# Altium schematic sheet [07] - RS232.SchDoc: IMXBB
size A3; DocumentNumber: 7; Revision: 2.0; SheetNumber: 7; SheetTotal: 13
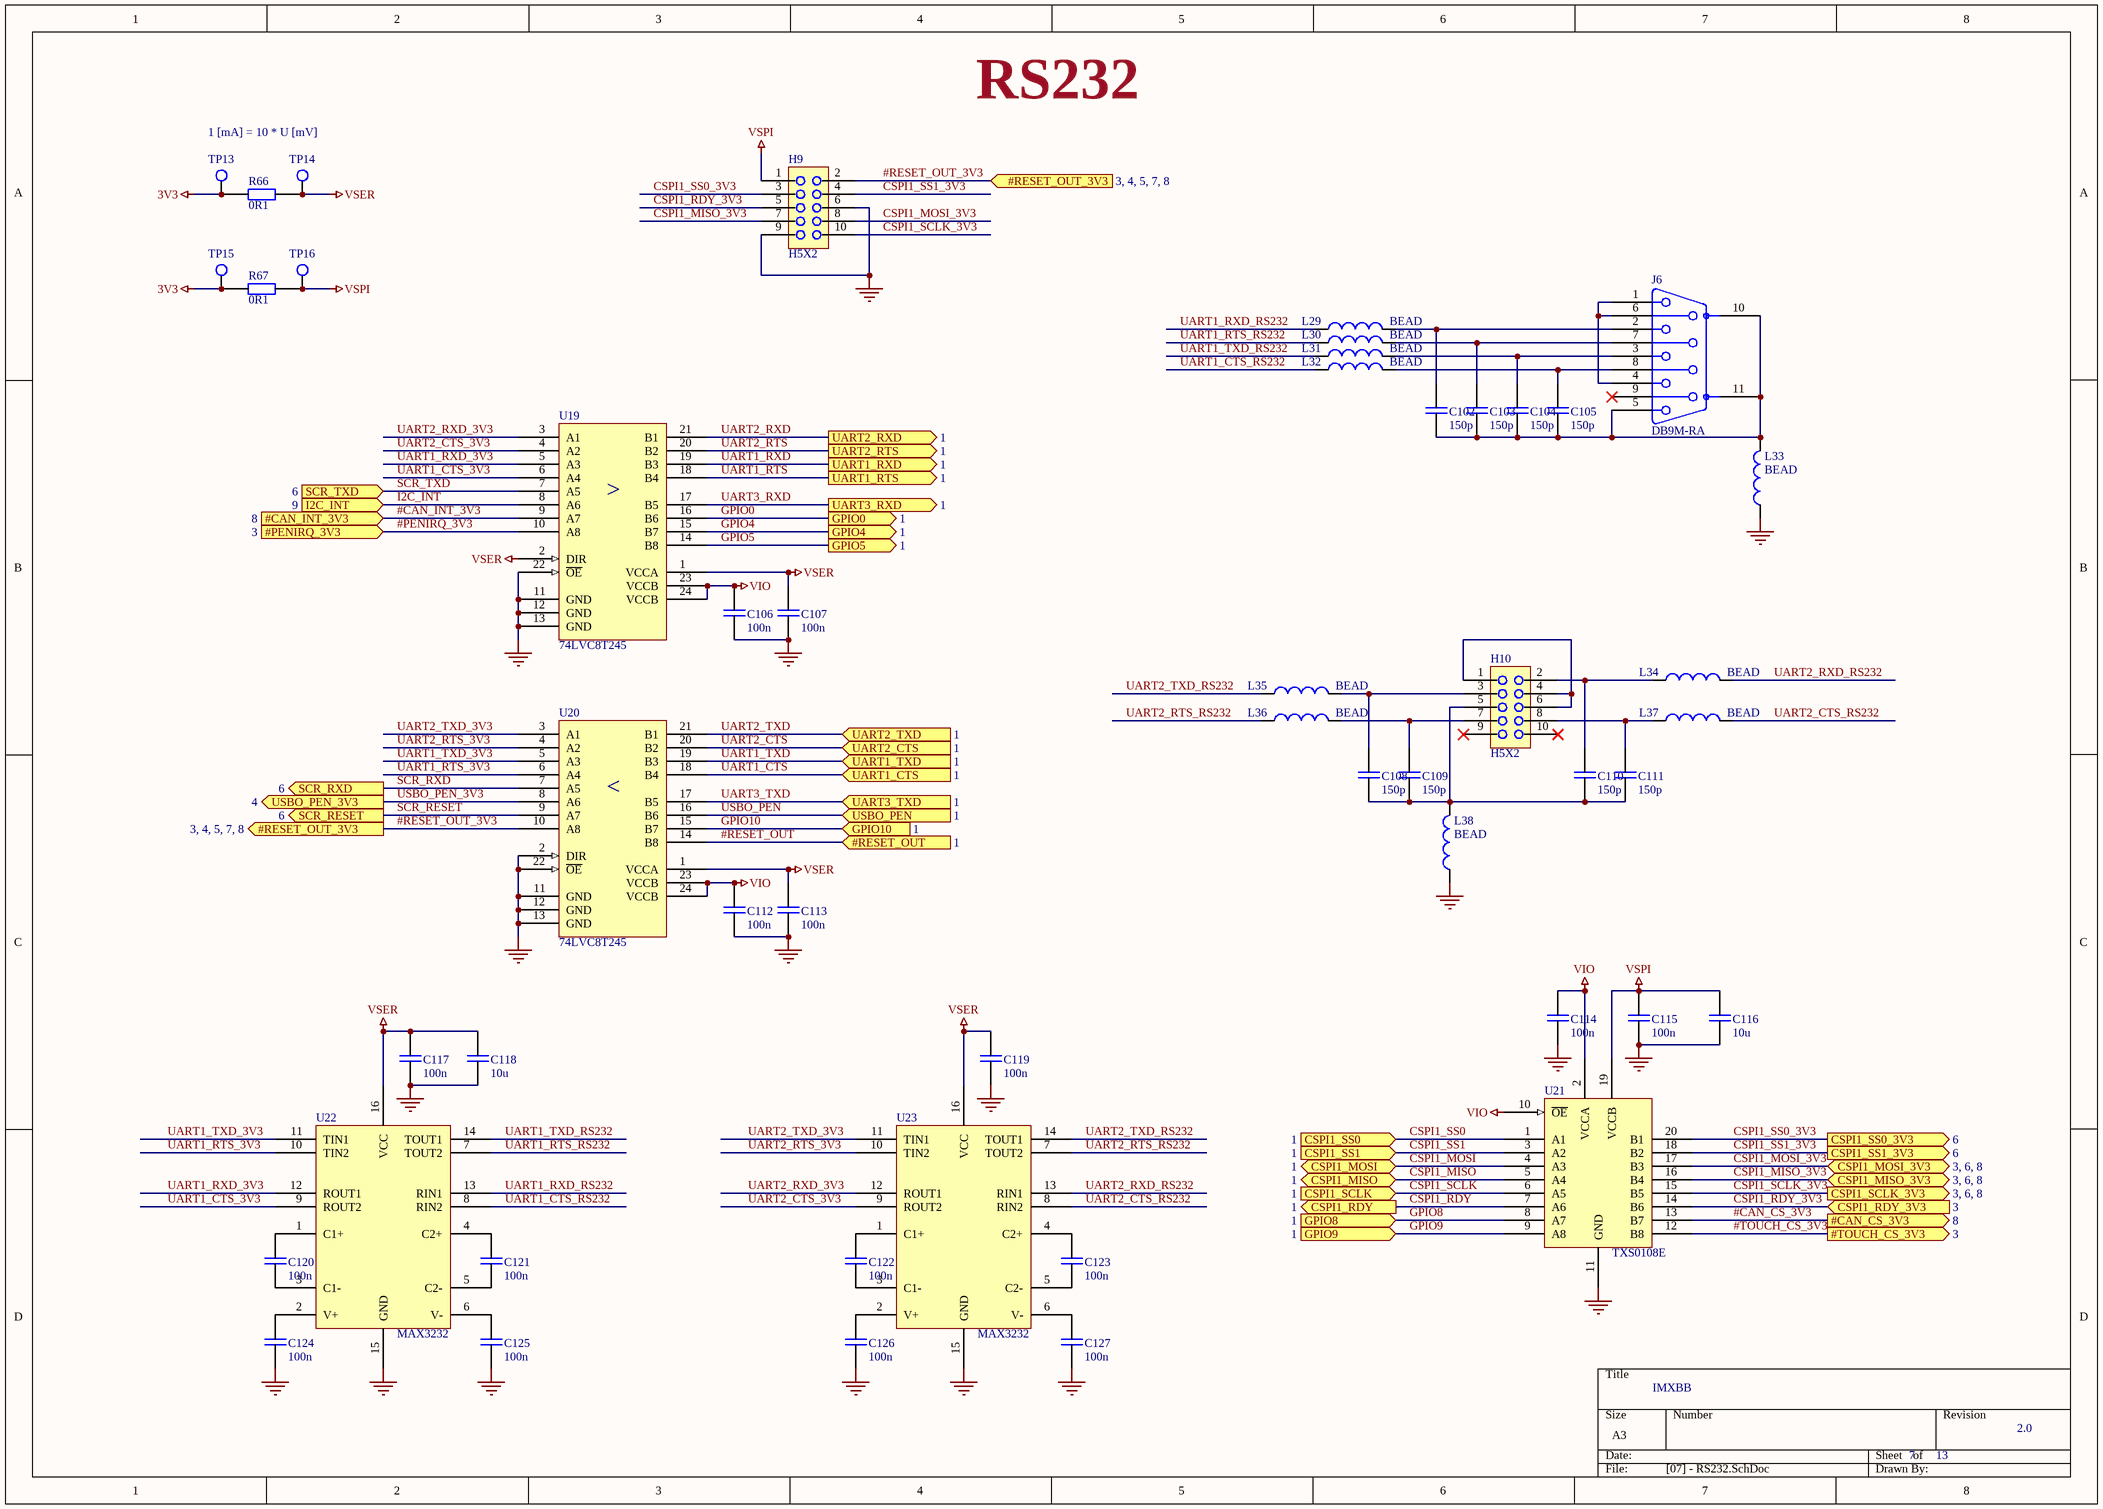
[diagram p0: [07] - RS232.SchDoc]

## Parts
C102  150p  [0603]
C103  150p  [0603]
C104  150p  [0603]
C105  150p  [0603]
C106  100n  [0603]
C107  100n  [0603]
C108  150p  [0603]
C109  150p  [0603]
C110  150p  [0603]
C111  150p  [0603]
C112  100n  [0603]
C113  100n  [0603]
C114  100n  [0603]
C115  100n  [0603]
C116  10u  [0805]
C117  100n  [0603]
C118  10u  [0805]
C119  100n  [0603]
C120  100n  [0603]
C121  100n  [0603]
C122  100n  [0603]
C123  100n  [0603]
C124  100n  [0603]
C125  100n  [0603]
C126  100n  [0603]
C127  100n  [0603]
H9  H5X2  [H2x5]
H10  H5X2  [H2x5]
J6  DB9M-RA  [DRA9_M_RA]
L29  BEAD  [0603]
L30  BEAD  [0603]
L31  BEAD  [0603]
L32  BEAD  [0603]
L33  BEAD  [0603]
L34  BEAD  [0603]
L35  BEAD  [0603]
L36  BEAD  [0603]
L37  BEAD  [0603]
L38  BEAD  [0603]
R66  0R1  [0603]
R67  0R1  [0603]
TP13  TESTPOINT  [TESTPOINT_2mm]  (value not drawn)
TP14  TESTPOINT  [TESTPOINT_2mm]  (value not drawn)
TP15  TESTPOINT  [TESTPOINT_2mm]  (value not drawn)
TP16  TESTPOINT  [TESTPOINT_2mm]  (value not drawn)
U19  74LVC8T245  [TSSOP24]
U20  74LVC8T245  [TSSOP24]
U21  TXS0108E  [TSSOP20]
U22  MAX3232  [SOIC16N]
U23  MAX3232  [SOIC16N]

## Ports
#CAN_CS_3V3 (out, see 8), #CAN_INT_3V3 (in, see 8), #PENIRQ_3V3 (in, see 3), #RESET_OUT (in, see 1), #RESET_OUT_3V3 (in, see 3, 4, 5, 7, 8), #RESET_OUT_3V3 (out, see 3, 4, 5, 7, 8), #TOUCH_CS_3V3 (out, see 3), CSPI1_MISO (bidir, see 1), CSPI1_MISO_3V3 (bidir, see 3, 6, 8), CSPI1_MOSI (bidir, see 1), CSPI1_MOSI_3V3 (bidir, see 3, 6, 8), CSPI1_RDY (out, see 1), CSPI1_RDY_3V3 (in, see 3), CSPI1_SCLK (in, see 1), CSPI1_SCLK_3V3 (out, see 3, 6, 8), CSPI1_SS0 (in, see 1), CSPI1_SS0_3V3 (out, see 6), CSPI1_SS1 (in, see 1), CSPI1_SS1_3V3 (out, see 6), GPIO0 (out, see 1), GPIO4 (out, see 1), GPIO5 (out, see 1), GPIO8 (in, see 1), GPIO9 (in, see 1), GPIO10 (in, see 1), I2C_INT (in, see 9), SCR_RESET (out, see 6), SCR_RXD (out, see 6), SCR_TXD (in, see 6), UART1_CTS (in, see 1), UART1_RTS (out, see 1), UART1_RXD (out, see 1), UART1_TXD (in, see 1), UART2_CTS (in, see 1), UART2_RTS (out, see 1), UART2_RXD (out, see 1), UART2_TXD (in, see 1), UART3_RXD (out, see 1), UART3_TXD (in, see 1), USBO_PEN (in, see 1), USBO_PEN_3V3 (out, see 4)

## Nets
3V3: R66.1 R67.1 TP13.1 TP15.1
GND: C106.1 C107.1 C112.1 C113.1 C114.1 C115.1 C116.1 C117.1 C118.1 C119.1 C124.1 C125.1 C126.1 C127.1 H9.6 H9.9 L33.1 L38.1 U19.11(GND) U19.12(GND) U19.13(GND) U19.22(~{OE}) U20.2(DIR) U20.11(GND) U20.12(GND) U20.13(GND) U20.22(~{OE}) U21.11(GND) U22.15(GND) U23.15(GND)
VIO: C106.2 C112.2 C114.2 U19.23(VCCB) U19.24(VCCB) U20.23(VCCB) U20.24(VCCB) U21.2(VCCA) U21.10(~{OE})
VSER: C107.2 C113.2 C117.2 C118.2 C119.2 R66.2 TP14.1 U19.1(VCCA) U19.2(DIR) U20.1(VCCA) U22.16(VCC) U23.16(VCC)
VSPI: C115.2 C116.2 H9.1 R67.2 TP16.1 U21.19(VCCB)
#CAN_CS_3V3: U21.13(B7) ; port #CAN_CS_3V3
#CAN_INT_3V3: U19.9(A7) ; port #CAN_INT_3V3
#PENIRQ_3V3: U19.10(A8) ; port #PENIRQ_3V3
#RESET_OUT: U20.14(B8) ; port #RESET_OUT
#RESET_OUT_3V3: H9.2 U20.10(A8) ; port #RESET_OUT_3V3
#TOUCH_CS_3V3: U21.12(B8) ; port #TOUCH_CS_3V3
CSPI1_MISO: U21.5(A4) ; port CSPI1_MISO
CSPI1_MISO_3V3: H9.7 U21.16(B4) ; port CSPI1_MISO_3V3
CSPI1_MOSI: U21.4(A3) ; port CSPI1_MOSI
CSPI1_MOSI_3V3: H9.8 U21.17(B3) ; port CSPI1_MOSI_3V3
CSPI1_RDY: U21.7(A6) ; port CSPI1_RDY
CSPI1_RDY_3V3: H9.5 U21.14(B6) ; port CSPI1_RDY_3V3
CSPI1_SCLK: U21.6(A5) ; port CSPI1_SCLK
CSPI1_SCLK_3V3: H9.10 U21.15(B5) ; port CSPI1_SCLK_3V3
CSPI1_SS0: U21.1(A1) ; port CSPI1_SS0
CSPI1_SS0_3V3: H9.3 U21.20(B1) ; port CSPI1_SS0_3V3
CSPI1_SS1: U21.3(A2) ; port CSPI1_SS1
CSPI1_SS1_3V3: H9.4 U21.18(B2) ; port CSPI1_SS1_3V3
GPIO0: U19.16(B6) ; port GPIO0
GPIO4: U19.15(B7) ; port GPIO4
GPIO5: U19.14(B8) ; port GPIO5
GPIO8: U21.8(A7) ; port GPIO8
GPIO9: U21.9(A8) ; port GPIO9
GPIO10: U20.15(B7) ; port GPIO10
I2C_INT: U19.8(A6) ; port I2C_INT
SCR_RESET: U20.9(A7) ; port SCR_RESET
SCR_RXD: U20.7(A5) ; port SCR_RXD
SCR_TXD: U19.7(A5) ; port SCR_TXD
UART1_CTS: U20.18(B4) ; port UART1_CTS
UART1_CTS_3V3: U19.6(A4) U22.9(ROUT2)
UART1_CTS_RS232: L32.1 U22.8(RIN2)
UART1_RTS: U19.18(B4) ; port UART1_RTS
UART1_RTS_3V3: U20.6(A4) U22.10(TIN2)
UART1_RTS_RS232: L30.1 U22.7(TOUT2)
UART1_RXD: U19.19(B3) ; port UART1_RXD
UART1_RXD_3V3: U19.5(A3) U22.12(ROUT1)
UART1_RXD_RS232: L29.1 U22.13(RIN1)
UART1_TXD: U20.19(B3) ; port UART1_TXD
UART1_TXD_3V3: U20.5(A3) U22.11(TIN1)
UART1_TXD_RS232: L31.1 U22.14(TOUT1)
UART2_CTS: U20.20(B2) ; port UART2_CTS
UART2_CTS_3V3: U19.4(A2) U23.9(ROUT2)
UART2_CTS_RS232: L37.2 U23.8(RIN2)
UART2_RTS: U19.20(B2) ; port UART2_RTS
UART2_RTS_3V3: U20.4(A2) U23.10(TIN2)
UART2_RTS_RS232: L36.1 U23.7(TOUT2)
UART2_RXD: U19.21(B1) ; port UART2_RXD
UART2_RXD_3V3: U19.3(A1) U23.12(ROUT1)
UART2_RXD_RS232: L34.2 U23.13(RIN1)
UART2_TXD: U20.21(B1) ; port UART2_TXD
UART2_TXD_3V3: U20.3(A1) U23.11(TIN1)
UART2_TXD_RS232: L35.1 U23.14(TOUT1)
UART3_RXD: U19.17(B5) ; port UART3_RXD
UART3_TXD: U20.17(B5) ; port UART3_TXD
USBO_PEN: U20.16(B6) ; port USBO_PEN
USBO_PEN_3V3: U20.8(A6) ; port USBO_PEN_3V3
NetC102_1: C102.1 C103.1 C104.1 C105.1 J6.5 J6.10(SHIELD) J6.11(SHIELD) L33.2
NetC102_2: C102.2 J6.2 L29.2
NetC103_2: C103.2 J6.7 L30.2
NetC104_2: C104.2 J6.3 L31.2
NetC105_2: C105.2 J6.8 L32.2
NetC108_1: C108.1 C109.1 C110.1 C111.1 H10.5 L38.2
NetC108_2: C108.2 H10.3 L35.2
NetC109_2: C109.2 H10.7 L36.2
NetC110_2: C110.2 H10.2 L34.1
NetC111_2: C111.2 H10.8 L37.1
NetC120_1: C120.1 U22.3(C1-)
NetC120_2: C120.2 U22.1(C1+)
NetC121_1: C121.1 U22.5(C2-)
NetC121_2: C121.2 U22.4(C2+)
NetC122_1: C122.1 U23.3(C1-)
NetC122_2: C122.2 U23.1(C1+)
NetC123_1: C123.1 U23.5(C2-)
NetC123_2: C123.2 U23.4(C2+)
NetC124_2: C124.2 U22.2(V+)
NetC125_2: C125.2 U22.6(V-)
NetC126_2: C126.2 U23.2(V+)
NetC127_2: C127.2 U23.6(V-)
NetH10_1: H10.1 H10.4 H10.6
NetJ6_1: J6.1 J6.4 J6.6

Not connected (* = marked no-connect by the designer): H10 9* 10*; J6 9(17)*

## Notes on the sheet
- RS232
- 1 [mA] = 10 * U [mV]
- (near U19) >
- (near U20) <

## Library data of the parts
C102-C127 = C
L29-L38 = FBEAD
R66 R67 = R
TP13-TP16 = TESTPOINT: Testpoint pad; Order number: no component; Component class: TP; Producer: n/a; Assembly type: no component